# Altium schematic sheet Clock_1to20_Buffer.SchDoc
size A4
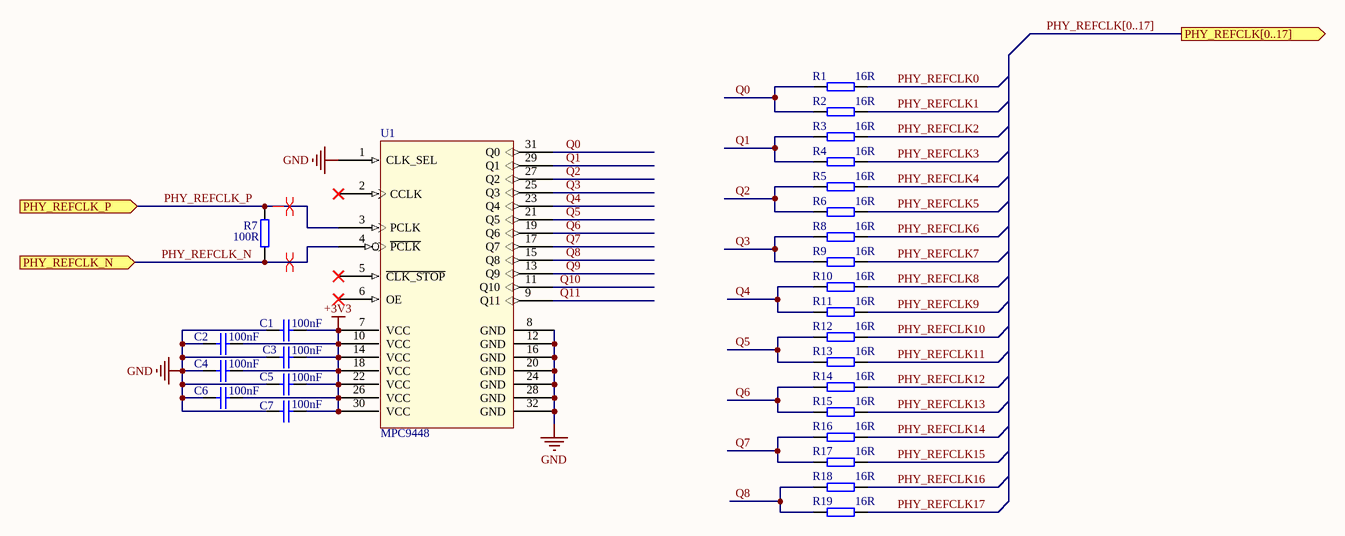
[diagram p0: Clock_1to20_Buffer.SchDoc]

## Parts
C1  100nF  [CC1608-0603]
C2  100nF  [CC1608-0603]
C3  100nF  [CC1608-0603]
C4  100nF  [CC1608-0603]
C5  100nF  [CC1608-0603]
C6  100nF  [CC1608-0603]
C7  100nF  [CC1608-0603]
R1  16R  [0603]
R2  16R  [0603]
R3  16R  [0603]
R4  16R  [0603]
R5  16R  [0603]
R6  16R  [0603]
R7  100R  [0603]
R8  16R  [0603]
R9  16R  [0603]
R10  16R  [0603]
R11  16R  [0603]
R12  16R  [0603]
R13  16R  [0603]
R14  16R  [0603]
R15  16R  [0603]
R16  16R  [0603]
R17  16R  [0603]
R18  16R  [0603]
R19  16R  [0603]
U1  MPC9448  [QFP80P900X900X160-32AN]

## Ports
PHY_REFCLK[0..17] (out), PHY_REFCLK_N (in), PHY_REFCLK_P (in)

## Nets
+3V3: C1.1 C2.1 C3.1 C4.1 C5.1 C6.1 C7.1 U1.7(VCC) U1.10(VCC) U1.14(VCC) U1.18(VCC) U1.22(VCC) U1.26(VCC) U1.30(VCC)
GND: C1.2 C2.2 C3.2 C4.2 C5.2 C6.2 C7.2 U1.1(CLK_SEL) U1.8(GND) U1.12(GND) U1.16(GND) U1.20(GND) U1.24(GND) U1.28(GND) U1.32(GND)
PHY_REFCLK0: R1.2
PHY_REFCLK1: R2.2
PHY_REFCLK2: R3.2
PHY_REFCLK3: R4.2
PHY_REFCLK4: R5.2
PHY_REFCLK5: R6.2
PHY_REFCLK6: R8.2
PHY_REFCLK7: R9.2
PHY_REFCLK8: R10.2
PHY_REFCLK9: R11.2
PHY_REFCLK10: R12.2
PHY_REFCLK11: R13.2
PHY_REFCLK12: R14.2
PHY_REFCLK13: R15.2
PHY_REFCLK14: R16.2
PHY_REFCLK15: R17.2
PHY_REFCLK16: R18.2
PHY_REFCLK17: R19.2
PHY_REFCLK_N: R7.2 U1.4(~{PCLK}) ; port PHY_REFCLK_N
PHY_REFCLK_P: R7.1 U1.3(PCLK) ; port PHY_REFCLK_P
Q0: R1.1 R2.1 U1.31(Q0)
Q1: R3.1 R4.1 U1.29(Q1)
Q2: R5.1 R6.1 U1.27(Q2)
Q3: R8.1 R9.1 U1.25(Q3)
Q4: R10.1 R11.1 U1.23(Q4)
Q5: R12.1 R13.1 U1.21(Q5)
Q6: R14.1 R15.1 U1.19(Q6)
Q7: R16.1 R17.1 U1.17(Q7)
Q8: R18.1 R19.1 U1.15(Q8)
Q9: U1.13(Q9)
Q10: U1.11(Q10)
Q11: U1.9(Q11)

Not connected (* = marked no-connect by the designer): U1 2(CCLK)* 5(~{CLK_STOP})* 6(OE)*

## Buses and harness runs
bus PHY_REFCLK[0..17] = port PHY_REFCLK[0..17]

## Layout directives
differential pair: PHY_REFCLK_N, PHY_REFCLK_P

## Library data of the parts
C1-C7 = CC0603_100NF_16V_10%_X7R: Capacitor; Manufacturer1: AVX; Manufacturer1 PN: 0603YC104KAT2A; TC: X7R; Tolerance: ±10%; Voltage: 16V; Published: 8-Jun-2000; LatestRevisionDate: 17-Jul-2002; LatestRevisionNote: Re-released for DXP Platform.; PackageReference: RAD-0.3; Publisher: Altium Limited; Distributor1: Digikey; Distributor1 PN: 478-1239-1-ND; Case: 0603; Value: 100nF
R1-R6 R8-R19 = R0603_16R0_±1%_0.1W_100PPM: SMD Resistor; Manufacturer1: Yageo; Manufacturer1 PN: RC0603FR-0716RL; TCR: 100ppm; Power Rating: 0.1W; Tolerance: ±1%; Case: 0603; Distributor1: DigiKey; Distributor1 PN: 311-16.0HRCT-ND; Value: 16R
R7 = R0603_100R_±1%_0.1W_100PPM: SMD Resistor; Manufacturer1: Yageo; Manufacturer1 PN: RC0603FR-07100RL; TCR: 100ppm; Power Rating: 0.1W; Tolerance: ±1%; Case: 0603; Distributor1: DigiKey; Distributor1 PN: 311-100HRCT-ND; Value: 100R
U1 = MPC9448: 3.3V/2.5V LVCMOS 1:12 Low Skew Clock Fanout Buffer; Manufacturer1 PN: MPC9448FA; Manufacturer1: IDT; Distributor1: Digikey; Distributor1 PN: 800-2012-ND